# Altium project Booster_Channel_RF_HL.PrjPcb
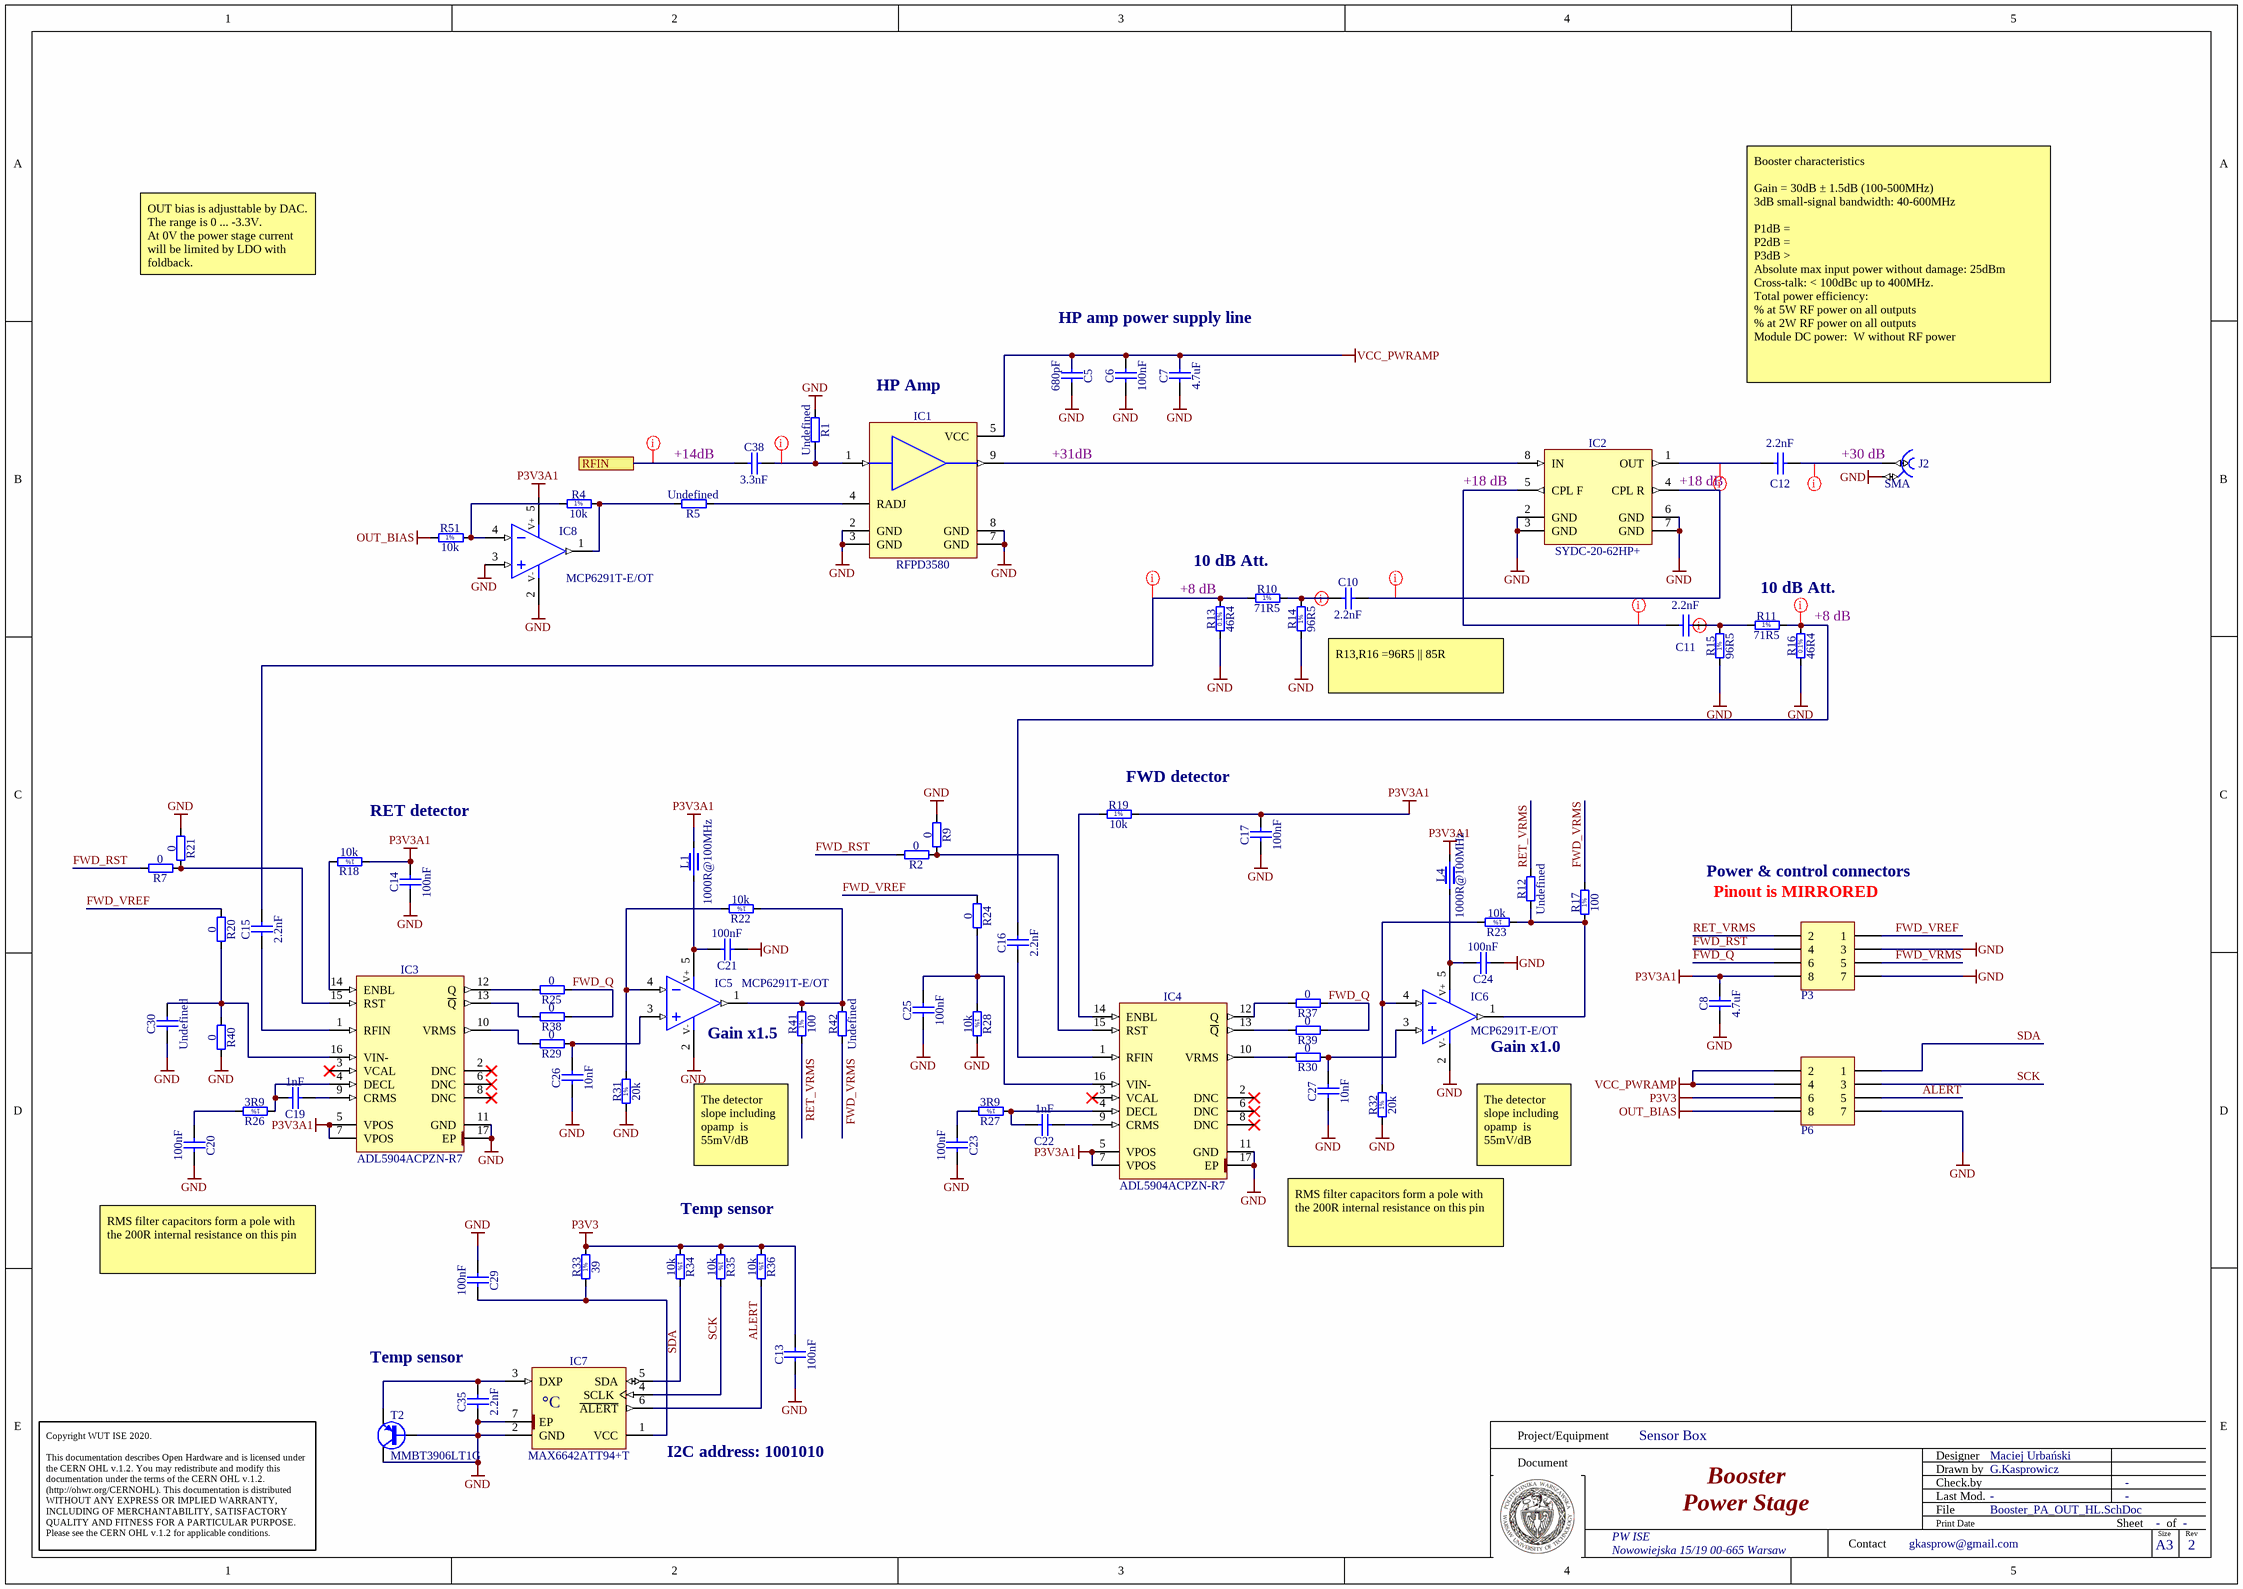
[diagram p0: Booster_PA_OUT_HL.SchDoc]
1 sheet, 79 parts. Net scope: flat (ports and power ports of the same name join across sheets).
Board file: Booster_Channel_RF_HL.PcbDoc

## Sheet Booster_PA_OUT_HL.SchDoc: Booster
size 420 x 297 mm; Comments: Power amplifier section for RFPA; Wersja: 1.0; CustomerInfo: Technosystem sp. z.o.o; CustomerAddress: ul. Okulickiego 7/9 05-500 Piaseczno, NIP 1231350775; CopyrightDate: 2018; TopSheet: RFPA_PA_OUT.SchDoc; CurrentSheet: RFPA_PA_OUT; Author: G.Kasprowicz; CompanyName: WUT ISE; DrawnBy: G.Kasprowicz; Organization: WUT ISE; Address1: PW ISE; Address2: Nowowiejska 15/19 00-665 Warsaw; Address3: gkasprow@gmail.com; Revision: 2; SheetNumber: -; SheetTotal: -; ModifiedBy: -; CheckedDate: -; Title2: Power Stage; DivGrp: WUT ISE; Designer: Maciej Urbański; ModifiedDate: -; ProjectName: Sensor Box

### Parts
C5  680pF  [CAPC1608X87N]
C6  100nF  [CAPC1005X55N]
C7  4.7uF  [CAPC3225X270N]
C8  4.7uF  [CAPC1709X95N]
C10  2.2nF  [CAPC1608X87N]
C11  2.2nF  [CAPC1608X87N]
C12  2.2nF  [CAPC1608X87N]
C13  100nF  [CAPC1005X55N]
C14  100nF  [CAPC1005X55N]
C15  2.2nF  [CAPC1608X87N]
C16  2.2nF  [CAPC1608X87N]
C17  100nF  [CAPC1005X55N]
C19  1nF  [CAPC1005X55N]
C20  100nF  [CAPC1005X55N]
C21  100nF  [CAPC1005X55N]
C22  1nF  [CAPC1005X55N]
C23  100nF  [CAPC1005X55N]
C24  100nF  [CAPC1005X55N]
C25  100nF  [CAPC1005X55N]
C26  10nF  [CAPC1005X55N]
C27  10nF  [CAPC1005X55N]
C29  100nF  [CAPC1005X55N]
C30  Undefined  [CAPC1608X90N]
C35  2.2nF  [CAPC1608X87N]
C38  3.3nF  [CAPC1608X87N]
IC1  RFPD3580  [SOT-115J_reversed]
IC2  SYDC-20-62HP+  [MINI-CIRCUITS_AH202-1]
IC3  ADL5904ACPZN-R7  [QFN50P300X300X80-17N-S175]
IC4  ADL5904ACPZN-R7  [QFN50P300X300X80-17N-S175]
IC5  MCP6291T-E/OT  [SOT95P270X145-5N]
IC6  MCP6291T-E/OT  [SOT95P270X145-5N]
IC7  MAX6642ATT94+T  [SON95P300X300X80-7N-R160X240]
IC8  MCP6291T-E/OT  [SOT95P270X145-5N]
J2  SMA  [MOLEX_73251-2120]
L1  1000R@100MHz  [INDC1608X95N]
L4  1000R@100MHz  [INDC1608X95N]
P3  ZL264-8DG  [HDR2X4_SMD]  (value not drawn)
P6  ZL264-8DG  [HDR2X4_SMD]  (value not drawn)
R1  Undefined  [RESC1608X55N]
R2  0  [RESC1005X40N]
R4  10k  [RESC1005X40N]
R5  Undefined  [RESC1608X55N]
R7  0  [RESC1005X40N]
R9  0  [RESC1005X40N]
R10  71R5  [RESC1608X55N]
R11  71R5  [RESC1608X55N]
R12  Undefined  [RESC1608X55N]
R13  46R4  [RESC1608X55N]
R14  96R5  [RESC1608X55N]
R15  96R5  [RESC1608X55N]
R16  46R4  [RESC1608X55N]
R17  100  [RESC1608X55N]
R18  10k  [RESC1005X40N]
R19  10k  [RESC1005X40N]
R20  0  [RESC1005X40N]
R21  0  [RESC1005X40N]
R22  10k  [RESC1005X40N]
R23  10k  [RESC1005X40N]
R24  0  [RESC1005X40N]
R25  0  [RESC1005X40N]
R26  3R9  [RESC1005X40N]
R27  3R9  [RESC1005X40N]
R28  10k  [RESC1005X40N]
R29  0  [RESC1005X40N]
R30  0  [RESC1005X40N]
R31  20k  [RESC1608X55N]
R32  20k  [RESC1608X55N]
R33  39  [RESC1608X55N]
R34  10k  [RESC1005X40N]
R35  10k  [RESC1005X40N]
R36  10k  [RESC1005X40N]
R37  0  [RESC1005X40N]
R38  0  [RESC1005X40N]
R39  0  [RESC1005X40N]
R40  0  [RESC1005X40N]
R41  100  [RESC1608X55N]
R42  Undefined  [RESC1608X55N]
R51  10k  [RESC1005X40N]
T2  MMBT3906LT1G  [SOT95P240X110-3N]

### Ports
RFIN

### Nets
GND: C5.1 C6.1 C7.1 C8.1 C13.1 C14.1 C17.1 C20.2 C21.1 C23.2 C24.1 C25.1 C26.1 C27.1 C29.1 C30.1 C35.1 IC1.2(GND) IC1.3(GND) IC1.7(GND) IC1.8(GND) IC2.2(GND) IC2.3(GND) IC2.6(GND) IC2.7(GND) IC3.11(GND) IC3.17(EP) IC4.11(GND) IC4.17(EP) IC5.2(V-) IC6.2(V-) IC7.2(GND) IC7.7(EP) IC8.2(V-) IC8.3(IN+) J2.2 P3.3 P3.7 P6.7 R1.1 R9.1 R13.1 R14.1 R15.1 R16.1 R21.1 R28.2 R31.1 R32.1 R40.2 T2.1(B) T2.3(C)
OUT_BIAS: P6.8 R51.1
P3V3: C13.2 P6.6 R33.2 R34.1 R35.1 R36.1
P3V3A1: C8.2 C14.2 C17.2 IC3.5(VPOS) IC3.7(VPOS) IC4.5(VPOS) IC4.7(VPOS) IC8.5(V+) L1.2 L4.2 P3.8 R18.1 R19.2
VCC_PWRAMP: C5.2 C6.2 C7.2 IC1.5(VCC) P6.2 P6.4
ALERT: IC7.6(~{ALERT}) P6.5 R36.2
FWD_Q: P3.6 R25.1 R37.1 R38.1 R39.1
FWD_RST: P3.4 R2.2 R7.2
FWD_VREF: P3.1 R20.1 R24.1
FWD_VRMS: P3.5 R17.2 R42.1
RET_VRMS: P3.2 R12.2 R41.1
SCK: IC7.4(SCLK) P6.3 R35.2
SDA: IC7.5(SDA) P6.1 R34.2
NetC10_1: C10.1 R10.2 R14.2
NetC10_2: C10.2 IC2.4(CPL_R)
NetC11_1: C11.1 R11.1 R15.2
NetC11_2: C11.2 IC2.5(CPL_F)
NetC12_1: C12.1 J2.1
NetC12_2: C12.2 IC2.1(OUT)
NetC15_1: C15.1 IC3.1(RFIN)
NetC15_2: C15.2 R10.1 R13.2
NetC16_1: C16.1 IC4.1(RFIN)
NetC16_2: C16.2 R11.2 R16.2
NetC19_1: C19.1 IC3.9(CRMS)
NetC19_2: C19.2 IC3.4(DECL) R26.1
NetC20_1: C20.1 R26.2
NetC21_2: C21.2 IC5.5(V+) L1.1
NetC22_1: C22.1 IC4.9(CRMS)
NetC22_2: C22.2 IC4.4(DECL) R27.1
NetC23_1: C23.1 R27.2
NetC24_2: C24.2 IC6.5(V+) L4.1
NetC25_2: C25.2 IC4.16(VIN-) R24.2 R28.1
NetC26_2: C26.2 IC5.3(IN+) R29.1
NetC27_2: C27.2 IC6.3(IN+) R30.1
NetC29_2: C29.2 IC7.1(VCC) R33.1
NetC30_2: C30.2 IC3.16(VIN-) R20.2 R40.1
NetC35_2: C35.2 IC7.3(DXP) T2.2(E)
NetC38_1: C38.1 IC1.1(RF_IN) R1.2
NetC38_2: C38.2 ; port RFIN
NetIC1_4: IC1.4(RADJ) R5.1
NetIC1_9: IC1.9(RF_OUT) IC2.8(IN)
NetIC3_10: IC3.10(VRMS) R29.2
NetIC3_12: IC3.12(Q) R25.2
NetIC3_13: IC3.13(~{Q}) R38.2
NetIC3_14: IC3.14(ENBL) R18.2
NetIC3_15: IC3.15(RST) R7.1 R21.2
NetIC4_10: IC4.10(VRMS) R30.2
NetIC4_12: IC4.12(Q) R37.2
NetIC4_13: IC4.13(~{Q}) R39.2
NetIC4_14: IC4.14(ENBL) R19.1
NetIC4_15: IC4.15(RST) R2.1 R9.2
NetIC5_1: IC5.1(OUT) R22.1 R41.2 R42.2
NetIC5_4: IC5.4(IN-) R22.2 R31.2
NetIC6_1: IC6.1(OUT) R12.1 R17.1 R23.1
NetIC6_4: IC6.4(IN-) R23.2 R32.2
NetIC8_1: IC8.1(OUT) R4.2 R5.2
NetIC8_4: IC8.4(IN-) R4.1 R51.2

Not connected (* = marked no-connect by the designer): IC3 2(DNC)* 3(VCAL)* 6(DNC)* 8(DNC)*; IC4 2(DNC)* 3(VCAL)* 6(DNC)* 8(DNC)*

### Layout directives
net class 50_Ohm: NetC10_1, NetC10_2, NetC11_1, NetC11_2, NetC12_1, NetC12_2, NetC15_2, NetC16_2, NetC38_1, NetC38_2

### Notes on the sheet
- OUT bias is adjusttable by DAC. The range is 0 ... -3.3V.
  At 0V the power stage current will be limited by LDO with foldback.
- HP amp power supply line
- HP Amp
- Booster characteristics
  Gain = 30dB ± 1.5dB (100-500MHz)
  3dB small-signal bandwidth: 40-600MHz
  P1dB =
  P2dB =
  P3dB >
  Absolute max input power without damage: 25dBm
  Cross-talk: < 100dBc up to 400MHz.
  Total power efficiency:
  % at 5W RF power on all outputs
  % at 2W RF power on all outputs
  Module DC power:  W without RF power
- +14dB
- +31dB
- (near J2) +30 dB
- (near IC2) +18 dB
- (near R13) +8 dB
- 10 dB Att.
- (near R16) +8 dB
- R13,R16 =96R5 || 85R
- (near R19) FWD detector
- RET detector
- Power & control connectors
- (near P3) Pinout is MIRRORED
- (near IC5) Gain x1.5
- (near IC6) Gain x1.0
- The detector slope including opamp  is 55mV/dB
- (near IC6) The detector slope including opamp  is 55mV/dB
- RMS filter capacitors form a pole with the 200R internal resistance on this pin
- Temp sensor
- (near C35) Temp sensor
- (near IC7) I2C address: 1001010
- Project/Equipment
- Document
- Designer
- Drawn by
- Check.by
- Copyright WUT ISE 2020.
  This documentation describes Open Hardware and is licensed under the CERN OHL v.1.2. You may redistribute and modify this documentation under the terms of the CERN OHL v.1.2. (http://ohwr.org/CERNOHL). This documentation is distributed WITHOUT ANY EXPRESS OR IMPLIED WARRANTY, INCLUDING OF MERCHANTABILITY, SATISFACTORY QUALITY AND FITNESS FOR A PARTICULAR PURPOSE. Please see the CERN OHL v.1.2 for applicable conditions.
- Contact
- File
- Last Mod.
- Print Date
- Sheet
- Size
- A3
- of
- Rev
- (in symbol MAX6642ATT94+T) °C
- (in symbol R0402_3R9_1%_0.0625W_200PPM) 1%
- (in symbol R0402_10k_1%_0.0625W_100PPM) 1%
- (in symbol R0603_20K_1%_0.1W_100PPM) 1%
- (in symbol R0603_39R_1%_0.1W_100PPM) 1%
- (in symbol R0603_46R4_0.1%_0.063W_10PPM) 0.1%
- (in symbol R0603_71R5_1%_0.1W_100PPM) 1%
- (in symbol R0603_96R5_0.5%_0.1W_50PPM) 1%
- (in symbol R0603_100R_1%_0.1W_100PPM) 1%

### Library data of the parts
C5 = CC0603_680PF_50V_5%_NP0: Non-polarised capacitor; Manufacturer: GENERIC; Part Description: SMD Multilayer Chip Ceramic Capacitor; Manufacturer1 Part Number: 223886715681; Voltage: 50V; TC: C0G/NP0; Tolerance: ±5%; Value: 680pF; Manufacturer Part Number: CC0603_680PF_50V_5%_NP0; Part Number: CC0603_680PF_50V_5%_NP0; Component Kind: Standard; Component Type: Standard; Pin Count: 2; Status: Preferred; Case: 0603; Mounted: Yes; Socket: No; SMD: Yes; Sense: No; Manufacturer1 Example: PHYCOMP; Manufacturer1 ComponentHeight: 0.87mm; HelpURL: \\cern.ch\dfs\Applications\Altium\Datasheets\CC0603_NP0_PHYCOMP.pdf; Author: CERN DEM JLC; CreateDate: 03.12.2007; LatestRevisionDate: 03.12.2007
C6 C13 C14 C17 C20 C21 C23-C25 C29 = CC0402_100NF_50V_10%_X7R: Non-polarised capacitor; Manufacturer: GENERIC; Part Description: SMD Multilayer Chip Ceramic Capacitor; Manufacturer1 Part Number: GRM155R71H104KE14D; Voltage: 50V; TC: X7R; Tolerance: ±10%; Value: 100nF; Manufacturer Part Number: CC0402_100NF_50V_10%_X7R; Part Number: CC0402_100NF_50V_10%_X7R; Component Kind: Standard; Component Type: Standard; Pin Count: 2; Status: None; Case: 0402; Mounted: Yes; Socket: No; SMD: Yes; Sense: No; Manufacturer1 Example: MURATA; Manufacturer1 ComponentHeight: 0.55mm; HelpURL: \\cern.ch\dfs\Applications\Altium\Datasheets\CC0402_MURATA_GRM155R71H104KE14D.pdf; Author: CERN DEM MR; CreateDate: 30/06/2017; LatestRevisionDate: 30/06/2017
C7 = CC1210_4.7UF_50V_10%_X7R: Non-polarised capacitor; Part Description: SMD Multilayer Chip Ceramic Capacitor; Manufacturer: GENERIC; Manufacturer1 Part Number: C1210C475K5RAC; Voltage: 50V; TC: X7R; Tolerance: ±10%; Part Number: CC1210_4.7UF_50V_10%_X7R; Component Kind: Standard; Component Type: Standard; Pin Count: 2; Value: 4.7uF; Status: None; Manufacturer Part Number: CC1210_4.7UF_50V_10%_X7R; Case: 1210; Mounted: Yes; Socket: No; SMD: Yes; Sense: No; Manufacturer1 Example: KEMET; Manufacturer1 ComponentHeight: 2.7mm; HelpURL: \\cern.ch\dfs\Applications\Altium\Datasheets\CC1210_X7R_KEMET.pdf; Author: CERN DEM JLC; CreateDate: 01.04.2009; LatestRevisionDate: 05.05.2009
C8 = CC0603_4.7UF_16V_10%_X5R: Non-polarised capacitor; Manufacturer: GENERIC; Part Description: SMD Multilayer Chip Ceramic Capacitor; Manufacturer1 Part Number: EMK107ABJ475KA-T; Voltage: 16V; TC: X5R; Tolerance: ±10%; Value: 4.7uF; Manufacturer Part Number: CC0603_4.7UF_16V_10%_X5R; Part Number: CC0603_4.7UF_16V_10%_X5R; Component Kind: Standard; Component Type: Standard; Pin Count: 2; Status: None; Case: 0603; Mounted: Yes; Socket: No; SMD: Yes; Sense: No; Manufacturer1 Example: TAIYO YUDEN; Manufacturer1 ComponentHeight: 0.95mm; HelpURL: \\cern.ch\dfs\Applications\Altium\Datasheets\CC0603_X7R_TAIYO-YUDEN_HIGH-VALUE.pdf; Author: CERN DEM JLC; CreateDate: 16.12.2013; LatestRevisionDate: 16.09.2014
C10 = CC0603_2.2NF_50V_5%_C0G: Non-polarised capacitor; Part Description: SMD Multilayer Chip Ceramic Capacitor; Manufacturer: GENERIC; Manufacturer1 Part Number: C1608C0G1H222J080AA; Voltage: 50V; TC: C0G/NP0; Tolerance: ±5%; Part Number: CC0603_2.2NF_50V_5%_C0G; Component Kind: Standard; Component Type: Standard; Pin Count: 2; Value: 2.2nF; Status: Preferred; Manufacturer Part Number: CC0603_2.2NF_50V_5%_C0G; Case: 0603; Mounted: Yes; Socket: No; SMD: Yes; Sense: No; Manufacturer1 Example: TDK; Manufacturer1 ComponentHeight: 0.9mm; HelpURL: \\cern.ch\dfs\Applications\Altium\Datasheets\CC0603_C0G_TDK_C.pdf; Author: CERN DEM JMW; CreateDate: 23.06.2014; LatestRevisionDate: 23.06.2014
C11 C12 C15 C16 C35 = CC0603_2.2NF_50V_5%_C0G: Non-polarised capacitor; Manufacturer: GENERIC; Part Description: SMD Multilayer Chip Ceramic Capacitor; Manufacturer1 Part Number: C1608C0G1H222J080AA; Voltage: 50V; TC: C0G/NP0; Tolerance: ±5%; Value: 2.2nF; Manufacturer Part Number: CC0603_2.2NF_50V_5%_C0G; Part Number: CC0603_2.2NF_50V_5%_C0G; Component Kind: Standard; Component Type: Standard; Pin Count: 2; Status: Preferred; Case: 0603; Mounted: Yes; Socket: No; SMD: Yes; Sense: No; Manufacturer1 Example: TDK; Manufacturer1 ComponentHeight: 0.9mm; HelpURL: \\cern.ch\dfs\Applications\Altium\Datasheets\CC0603_C0G_TDK_C.pdf; Author: CERN DEM JMW; CreateDate: 23.06.2014; LatestRevisionDate: 23.06.2014
C19 C22 = CC0402_1NF_50V_10%_X7R: Non-polarised capacitor; Part Description: SMD Multilayer Chip Ceramic Capacitor; Manufacturer: GENERIC; Manufacturer1 Part Number: 223858715623; Voltage: 50V; TC: X7R; Tolerance: ±10%; Part Number: CC0402_1NF_50V_10%_X7R; Component Kind: Standard; Component Type: Standard; Pin Count: 2; Value: 1nF; Status: Not Recommended; Manufacturer Part Number: CC0402_1NF_50V_10%_X7R; Case: 0402; Mounted: Yes; Socket: No; SMD: Yes; Sense: No; Manufacturer1 Example: PHYCOMP; Manufacturer1 ComponentHeight: 0.55mm; HelpURL: \\cern.ch\dfs\Applications\Altium\Datasheets\CC0402_X7R_PHYCOMP.pdf; Author: CERN DEM JLC; CreateDate: 03.12.2007; LatestRevisionDate: 03.12.2007
C26 C27 = CC0402_10NF_25V_10%_X7R: Non-polarised capacitor; Manufacturer: GENERIC; Part Description: SMD Multilayer Chip Ceramic Capacitor; Manufacturer1 Part Number: C1005X7R1E103KT; Voltage: 25V; TC: X7R; Tolerance: ±10%; Value: 10nF; Manufacturer Part Number: CC0402_10NF_25V_10%_X7R; Part Number: CC0402_10NF_25V_10%_X7R; Component Kind: Standard; Component Type: Standard; Pin Count: 2; Status: Preferred; Case: 0402; Mounted: Yes; Socket: No; SMD: Yes; Sense: No; Manufacturer1 Example: TDK; Manufacturer1 ComponentHeight: 0.55mm; HelpURL: \\cern.ch\dfs\Applications\Altium\Datasheets\CC0402_X7R_TDK_C.pdf; Author: CERN DEM JLC; CreateDate: 25.10.2012; LatestRevisionDate: 25.10.2012
C30 = CC0603_NO-VALUE: Non-polarised capacitor; Part Description: Reserved Footprint For 0603(1608) Chip Ceramic Capacitor; Mounted: No; Part Number: CC0603_NO-VALUE; Component Kind: Standard; Component Type: Standard; Pin Count: 2; Value: Undefined; Status: None; Manufacturer: Undefined; Manufacturer Part Number: CC0603_NO-VALUE; Case: 0603; Socket: No; SMD: Yes; Sense: No; Manufacturer1 ComponentHeight: 0.9mm; HelpURL: Undefined; Author: CERN DEM MR; CreateDate: 22.11.2016; LatestRevisionDate: 22.11.2016
C38 = CC0603_3.3NF_50V_5%_C0G: Non-polarised capacitor; Manufacturer: GENERIC; Part Description: SMD Multilayer Chip Ceramic Capacitor; Manufacturer1 Part Number: C1608C0G1H332J080AA; Voltage: 50V; TC: C0G/NP0; Tolerance: ±5%; Value: 3.3nF; Manufacturer Part Number: CC0603_3.3NF_50V_5%_C0G; Part Number: CC0603_3.3NF_50V_5%_C0G; Component Kind: Standard; Component Type: Standard; Pin Count: 2; Status: Preferred; Case: 0603; Mounted: Yes; Socket: No; SMD: Yes; Sense: No; Manufacturer1 Example: TDK; Manufacturer1 ComponentHeight: 0.9mm; HelpURL: \\cern.ch\dfs\Applications\Altium\Datasheets\CC0603_C0G_TDK_C.pdf; Author: CERN DEM MR; CreateDate: 02.11.2016; LatestRevisionDate: 02.11.2016
IC1 = RF_RFPD3580: GaAs/GaN Power Doubler Hybrid / 45MHz to 1218MHz; Manufacturer: QORVO; PressFit: No; Bonding: No; Part Number: RFPD3580; Component Kind: Standard; Component Type: Standard; Device: RFPD3580; Footprint: SOT-115J; PackageDescription: SOT-115J 2.54 Hybrid module; Part Description: GaAs/GaN Power Doubler Hybrid; Manufacturer Part Number: RFPD3580; Pin Count: 6; Case: SOT-115J; Mounted: Yes; Socket: No; SMD: Yes; Sense: No; ComponentHeight: 1.1mm; Author: CERN DEM JLC; HelpURL: \\cern.ch\dfs\Applications\Altium\Datasheets\AG203-63G.pdf; CreateDate: 03.07.2017; LatestRevisionDate: 03.07.2017
IC2 = SYDC-20-62HP+: 50Ohm, 10 to 540MHz, 25W, 20dB Bi-Directional Coupler; Manufacturer: MINI-CIRCUITS; PressFit: No; Bonding: No; Part Number: SYDC-20-62HP+; Component Kind: Standard; Component Type: Standard; Device: SYDC-20-62HP+; PackageDescription: MINI-CIRCUITS AH202-1 Case, Body 12.7mm L X 9.65mm W X 6.35mm H; Part Description: 50Ohm, 10 to 540MHz, 25W, 20dB Bi-Directional Coupler; Manufacturer Part Number: SYDC-20-62HP+; Pin Count: 8; Mounted: Yes; Socket: No; SMD: Yes; Sense: No; ComponentHeight: 6.35mm; Author: CERN DEM BC; HelpURL: \\cern.ch\dfs\Applications\Altium\Datasheets\SYDC-20-62HP+.pdf; CreateDate: 26.08.2019; LatestRevisionDate: 26.08.2019
IC3 IC4 = ADL5904ACPZN-R7: DC to 6 GHz, 45 dB TruPwr Detector With Envelope Threshold Detection; Manufacturer: ANALOG DEVICES; PressFit: No; Bonding: No; Part Number: ADL5904ACPZN-R7; Component Kind: Standard; Component Type: Standard; Device: ADL5904ACPZN-R7; PackageDescription: QFN, 0.50mm Pitch, Square; 16 Pin, 3.00mm L X 3.00mm W X 0.80mm H Body (w/Thermal Tab 1.75 X 1.75mm),  IPC Medium Density; Part Description: DC to 6 GHz, 45 dB TruPwr Detector With Envelope Threshold Detection; Manufacturer Part Number: ADL5904ACPZN-R7; Pin Count: 17; Case: QFN16; Mounted: Yes; Socket: No; SMD: Yes; Sense: No; ComponentHeight: 0.8mm; Author: CERN DEM MR; HelpURL: \\cern.ch\dfs\Applications\Altium\Datasheets\ADL5904ACPZN-R7.pdf; CreateDate: 26.09.2017; LatestRevisionDate: 26.09.2017
IC5 IC6 IC8 = MCP6291T-E/OT: Operational Amplifier; Part Description: 1.0mA, 10 MHz Rail-to-Rail Operational Amplifier; Manufacturer: MICROCHIP TECHNOLOGY; PressFit: No; Bonding: No; Part Number: MCP6291T-E/OT; Component Kind: Standard; Component Type: Standard; Device: MCP6291T-E/OT; PackageDescription: SOT, 0.95mm pitch; 5 pin, 1.55mm W X 2.90mm L X 1.45mm H body, IPC Medium Density; Manufacturer Part Number: MCP6291T-E/OT; Pin Count: 5; Case: SOT23-5; Mounted: Yes; Socket: No; SMD: Yes; Sense: No; ComponentHeight: 1.45mm; Author: CERN DEM BC; HelpURL: \\cern.ch\dfs\Applications\Altium\Datasheets\MCP6291T-E-OT.pdf; CreateDate: 22.08.2019; LatestRevisionDate: 22.08.2019
IC7 = MAX6642ATT94+T: ±1°C, SMBus-Compatible Remote/Local Temperature Sensor with Overtemperature Alarm; Part Description: 0°C to +125°C, ±1°C, SMBus-Compatible Remote/Local Temperature Sensor with Overtemperature Alarm (Address 1001 010); Manufacturer: MAXIM; PressFit: No; Bonding: No; Part Number: MAX6642ATT94+T; Component Kind: Standard; Component Type: Standard; Device: MAX6642ATT94+T; PackageDescription: SON, 0.95mm Pitch; 6 Pin, 3.00mm W X 3mm L X 0.80mm H body (w/Thermal Tab 1.6mm x 2.4mm); Manufacturer Part Number: MAX6642ATT94+T; Pin Count: 7; Case: SON6; Mounted: Yes; Socket: No; SMD: Yes; Sense: No; ComponentHeight: 0.8mm; HelpURL: \\cern.ch\dfs\Applications\Altium\Datasheets\MAX6642ATT94+T.pdf; Author: CERN DEM JLC; CreateDate: 26.11.2013; LatestRevisionDate: 26.11.2013
J2 = CON_SMA_RA_SMD_73251-2120: 50 Ohm, SMA Edge Mount PCB, With Jam Nut And Lock Washer; Manufacturer: MOLEX; PressFit: No; Part Number: MOLEX_73251-2120; Component Kind: Standard; Component Type: Standard; Pin Count: 5; Family: SMA; Mounted: Yes; Socket: No; SMD: Yes; Sense: No; Status: None; Part Description: 50 Ohm, SMA Edge Mount PCB, With Jam Nut And Lock Washer; Manufacturer Part Number: 73251-2120; ComponentHeight: 5.75mm; HelpURL: \\cern.ch\dfs\Applications\Altium\Datasheets\MOLEX_73251-2121.pdf; Author: CERN DEM JLC; CreateDate: 26.10.2016; LatestRevisionDate: 26.10.2016
L1 L4 = IND0603_MURATA_BLM18HE102SN1: Manufacturer: MURATA; Part Description: SMD EMIFIL Suppression Chip Ferrite Bead; Power: 600mA; Resistance: 0.35R; Tolerance: ±25%; Value: 1000R@100MHz; Manufacturer Part Number: BLM18HE102SN1; Part Number: IND0603_MURATA_BLM18HE102SN1; Component Kind: Standard; Component Type: Standard; Pin Count: 2; Status: None; Case: 0603; Mounted: Yes; Socket: No; SMD: Yes; Sense: No; ComponentHeight: 0.95mm; HelpURL: \\cern.ch\dfs\Applications\Altium\Datasheets\IND0603_MURATA_BLM18H.pdf; Author: CERN DEM JLC; CreateDate: 09.12.2013; LatestRevisionDate: 25.10.2018
P3 P6 = HDR2X4: Header, 4-Pin, Dual Row; Generic: yes; Remarks: ordinary goldpin socket; Value: -; Manufacturer: -; Manufacturer Part Number: -; Mounting type: SMT; Package: 2x4 pin SMD; Supplier 1: TME; Supplier 2: -; Supplier 3: -; Supplier Part Number 1: ZL264-8DG; Supplier Part Number 2: -; Supplier Part Number 3: -
R1 R5 R12 R42 = R0603_NO-VALUE: Resistor; Part Description: Reserved Footprint For a 0603 (1608) Chip Resistor; PressFit: No; Mounted: No; Value: Undefined; Manufacturer: Undefined; Manufacturer Part Number: R0603_NO-VALUE; Part Number: R0603_NO-VALUE; Component Kind: Standard; Component Type: Standard; Pin Count: 2; Status: None; Case: 0603; Sense: No; Socket: No; SMD: Yes; Manufacturer1 Example: Undefined; Manufacturer1 Part Number: Undefined; Manufacturer1 ComponentHeight: Undefined; HelpURL: Undefined; Author: CERN DEM JLC; CreateDate: 03.12.2007; LatestRevisionDate: 13.03.2008
R2 R7 R9 R20 R21 R24 R25 R29 R30 R37-R40 = R0402_0R_JUMPER: Resistor; Manufacturer: GENERIC; Part Description: 1A (0.05R Max DC Resistance) Zero Ohm Jumper; Manufacturer1 Part Number: 232270591001L; PressFit: No; Value: 0; Manufacturer Part Number: R0402_0R_JUMPER; Part Number: R0402_0R_JUMPER; Component Kind: Standard; Component Type: Standard; Pin Count: 2; Status: Not Recommended; Case: 0402; Mounted: Yes; Sense: No; Socket: No; SMD: Yes; Manufacturer1 Example: YAGEO PHYCOMP; Manufacturer1 ComponentHeight: 0.4mm; HelpURL: \\cern.ch\dfs\Applications\Altium\Datasheets\R0402_Phycomp_RC0402.pdf; Author: CERN DEM JLC; CreateDate: 03.12.2007; LatestRevisionDate: 17.10.2012
R4 R18 R22 R23 R28 R34-R36 R51 = R0402_10k_1%_0.0625W_100PPM: Resistor - 1%; Manufacturer: GENERIC; Part Description: General Purpose Thick Film Chip Resistor; Manufacturer1 Part Number: 232270671003L; TC: ±100ppm/°C; PressFit: No; Value: 10k; Manufacturer Part Number: R0402_10K_1%_0.0625W_100PPM; Part Number: R0402_10K_1%_0.0625W_100PPM; Component Kind: Standard; Component Type: Standard; Pin Count: 2; Status: Not Recommended; Power: 0.0625W; Tolerance: ±1%; Case: 0402; Mounted: Yes; Sense: No; Socket: No; SMD: Yes; Manufacturer1 Example: YAGEO PHYCOMP; Manufacturer1 ComponentHeight: 0.4mm; HelpURL: \\cern.ch\dfs\Applications\Altium\Datasheets\R0402_Phycomp_RC0402.pdf; Author: CERN DEM JLC; CreateDate: 03.12.2007; LatestRevisionDate: 17.10.2012
R10 R11 = R0603_71R5_1%_0.1W_100PPM: Resistor - 1%; Part Description: General Purpose Thick Film Chip Resistor; Manufacturer: GENERIC; Manufacturer1 Part Number: CRCW060371R5FKEA; Power: 0.1W; TC: ±100ppm/°C; PressFit: No; Part Number: R0603_71R5_1%_0.1W_100PPM; Component Kind: Standard; Component Type: Standard; Pin Count: 2; Value: 71R5; Status: Preferred; Tolerance: ±1%; Manufacturer Part Number: R0603_71R5_1%_0.1W_100PPM; Case: 0603; Mounted: Yes; Sense: No; Socket: No; SMD: Yes; Manufacturer1 Example: VISHAY; Manufacturer1 ComponentHeight: 0.50mm; HelpURL: \\cern.ch\dfs\Applications\Altium\Datasheets\R0603_VISHAY_CRCW e3.pdf; Author: CERN DEM JLC; CreateDate: 11.12.2013; LatestRevisionDate: 11.12.2013
R13 R16 = R0603_46R4_0.1%_0.063W_10PPM: Resistor - 0.1%; Part Description: Thin Film Chip Resistor; Manufacturer: GENERIC; Manufacturer1 Part Number: RN73C1J46R4BTDF; Power: 0.063W; TC: ±10ppm; PressFit: No; Part Number: R0603_46R4_0.1%_0.063W_10PPM; Component Kind: Standard; Component Type: Standard; Pin Count: 2; Value: 46R4; Status: Not Recommended; Tolerance: ±0.1%; Manufacturer Part Number: R0603_46R4_0.1%_0.063W_10PPM; Case: 0603; Mounted: Yes; Sense: No; Socket: No; SMD: Yes; Manufacturer1 Example: TYCO HOLSWORTHY; Manufacturer1 ComponentHeight: 0.5mm; HelpURL: \\cern.ch\dfs\Applications\Altium\Datasheets\R0603_Tyco_RN73.pdf; Author: CERN DEM JLC; CreateDate: 03.12.2007; LatestRevisionDate: 13.03.2008
R14 R15 = R0603_96R5_0.5%_0.1W_50PPM: Resistor - 0.5%; Part Description: General Purpose Thick Film Chip Resistor; Manufacturer: GENERIC; Manufacturer1 Part Number: RT0603DRE0796R5L; Power: 0.1W; TC: ±50ppm/°C; PressFit: No; Part Number: R0603_96R5_0.5%_0.1W_50PPM; Component Kind: Standard; Component Type: Standard; Pin Count: 2; Value: 96R5; Status: Preferred; Tolerance: ±0.5%; Manufacturer Part Number: R0603_96R5_0.5%_0.1W_50PPM; Case: 0603; Mounted: Yes; Sense: No; Socket: No; SMD: Yes; Manufacturer1 Example: Yaego; Manufacturer1 ComponentHeight: 0.55mm; HelpURL: \\cern.ch\dfs\Applications\Altium\Datasheets\R0603_NIC_NRC.pdf; Author: GK; CreateDate: 03.12.2007; LatestRevisionDate: 13.03.2008
R17 R41 = R0603_100R_1%_0.1W_100PPM: Resistor - 1%; Manufacturer: GENERIC; Part Description: General Purpose Thick Film Chip Resistor; Manufacturer1 Part Number: NRC06F4700TRF; Power: 0.1W; TC: ±100ppm/°C; PressFit: No; Value: 100; Manufacturer Part Number: R0603_100R_1%_0.1W_100PPM; Part Number: R0603_100R_1%_0.1W_100PPM; Component Kind: Standard; Component Type: Standard; Pin Count: 2; Status: Preferred; Tolerance: ±1%; Case: 0603; Mounted: Yes; Sense: No; Socket: No; SMD: Yes; Manufacturer1 Example: NIC COMPONENT; Manufacturer1 ComponentHeight: 0.55mm; HelpURL: \\cern.ch\dfs\Applications\Altium\Datasheets\R0603_NIC_NRC.pdf; Author: CERN DEM JLC; CreateDate: 03.12.2007; LatestRevisionDate: 13.03.2008
R19 = R0402_10k_1%_0.0625W_100PPM: Resistor - 1%; Part Description: General Purpose Thick Film Chip Resistor; Manufacturer: GENERIC; Manufacturer1 Part Number: 232270671003L; TC: ±100ppm/°C; PressFit: No; Part Number: R0402_10K_1%_0.0625W_100PPM; Component Kind: Standard; Component Type: Standard; Pin Count: 2; Value: 10k; Status: Not Recommended; Power: 0.0625W; Tolerance: ±1%; Manufacturer Part Number: R0402_10K_1%_0.0625W_100PPM; Case: 0402; Mounted: Yes; Sense: No; Socket: No; SMD: Yes; Manufacturer1 Example: YAGEO PHYCOMP; Manufacturer1 ComponentHeight: 0.4mm; HelpURL: \\cern.ch\dfs\Applications\Altium\Datasheets\R0402_Phycomp_RC0402.pdf; Author: CERN DEM JLC; CreateDate: 03.12.2007; LatestRevisionDate: 17.10.2012
R26 R27 = R0402_3R9_1%_0.0625W_200PPM: Resistor - 1%; Part Description: General Purpose Thick Film Chip Resistor; Manufacturer: GENERIC; Manufacturer1 Part Number: 232270673908L; TC: ±200ppm/°C; PressFit: No; Part Number: R0402_3R9_1%_0.0625W_200PPM; Component Kind: Standard; Component Type: Standard; Pin Count: 2; Value: 3R9; Status: Not Recommended; Power: 0.0625W; Tolerance: ±1%; Manufacturer Part Number: R0402_3R9_1%_0.0625W_200PPM; Case: 0402; Mounted: Yes; Sense: No; Socket: No; SMD: Yes; Manufacturer1 Example: YAGEO PHYCOMP; Manufacturer1 ComponentHeight: 0.4mm; HelpURL: \\cern.ch\dfs\Applications\Altium\Datasheets\R0402_Phycomp_RC0402.pdf; Author: CERN DEM JLC; CreateDate: 03.12.2007; LatestRevisionDate: 17.10.2012
R31 R32 = R0603_20K_1%_0.1W_100PPM: Resistor - 1%; Part Description: General Purpose Thick Film Chip Resistor; Manufacturer: GENERIC; Manufacturer1 Part Number: NRC06F2002TRF; Power: 0.1W; TC: ±100ppm/°C; PressFit: No; Part Number: R0603_20K_1%_0.1W_100PPM; Component Kind: Standard; Component Type: Standard; Pin Count: 2; Value: 20k; Status: Preferred; Tolerance: ±1%; Manufacturer Part Number: R0603_20K_1%_0.1W_100PPM; Case: 0603; Mounted: Yes; Sense: No; Socket: No; SMD: Yes; Manufacturer1 Example: NIC COMPONENT; Manufacturer1 ComponentHeight: 0.55mm; HelpURL: \\cern.ch\dfs\Applications\Altium\Datasheets\R0603_NIC_NRC.pdf; Author: CERN DEM JLC; CreateDate: 03.12.2007; LatestRevisionDate: 13.03.2008
R33 = R0603_39R_1%_0.1W_100PPM: Resistor - 1%; Part Description: General Purpose Thick Film Chip Resistor; Manufacturer: GENERIC; Manufacturer1 Part Number: NRC06F39R0TRF; Power: 0.1W; TC: ±100ppm/°C; PressFit: No; Part Number: R0603_39R_1%_0.1W_100PPM; Component Kind: Standard; Component Type: Standard; Pin Count: 2; Value: 39; Status: Preferred; Tolerance: ±1%; Manufacturer Part Number: R0603_39R_1%_0.1W_100PPM; Case: 0603; Mounted: Yes; Sense: No; Socket: No; SMD: Yes; Manufacturer1 Example: NIC COMPONENT; Manufacturer1 ComponentHeight: 0.55mm; HelpURL: \\cern.ch\dfs\Applications\Altium\Datasheets\R0603_NIC_NRC.pdf; Author: CERN DEM JLC; CreateDate: 03.12.2007; LatestRevisionDate: 13.03.2008
T2 = MMBT3906LT1G: PNP Transistor; Part Description: 40V 200mA PNP General Purpose Transistor; Manufacturer: ON SEMICONDUCTOR; PressFit: No; Bonding: No; Part Number: MMBT3906LT1G; Component Kind: Standard; Component Type: Standard; Device: MMBT3906LT1G; PackageDescription: SOT23 3-Leads, Pitch 0.95mm - Body 1.4x3mm, IPC Medium Density; Manufacturer Part Number: MMBT3906LT1G; Pin Count: 3; Case: SOT23-3; Mounted: Yes; Socket: No; SMD: Yes; Sense: No; ComponentHeight: 1.1mm; HelpURL: \\cern.ch\dfs\Applications\Altium\Datasheets\MMBT3906LT1G.pdf; Author: CERN DEM JLC; CreateDate: 29.03.2012; LatestRevisionDate: 29.03.2012

## Assembly variants
std: not fitted C25 C30 C56 J3 R2 R3 R5 R6 R7 R12 R20 R24 R25 R32 R37 R38 R39 R42 R45 R46 R48 R49 R50 R66 R69 R71 R72 U8